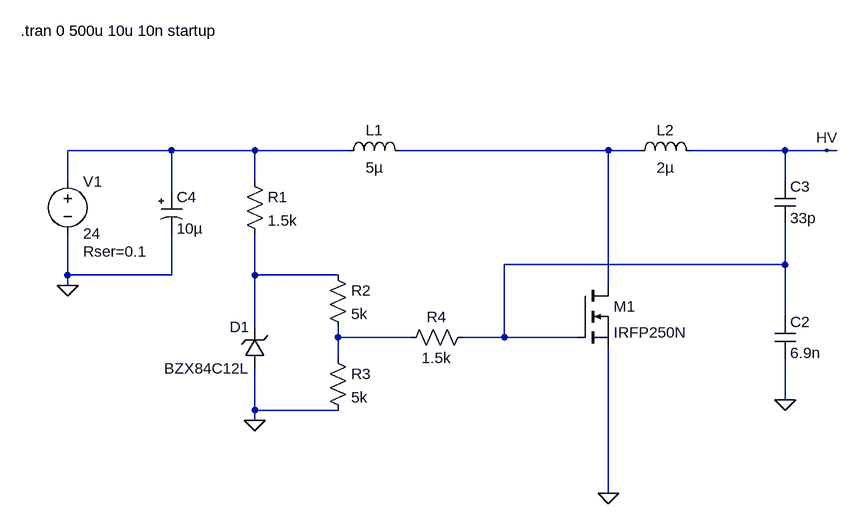
[diagram p0: schematic Generator_spice.asc]
Generator_spice.asc, the LTspice schematic file:
Version 4
SHEET 1 1444 804
WIRE 160 64 0 64
WIRE 288 64 160 64
WIRE 432 64 288 64
WIRE 832 64 512 64
WIRE 880 64 832 64
WIRE 1104 64 960 64
WIRE 1168 64 1104 64
WIRE 1184 64 1168 64
WIRE 0 112 0 64
WIRE 288 112 288 64
WIRE 1104 112 1104 64
WIRE 160 128 160 64
WIRE 1104 240 1104 176
WIRE 1104 240 672 240
WIRE 0 256 0 192
WIRE 160 256 160 192
WIRE 160 256 0 256
WIRE 288 256 288 192
WIRE 416 256 288 256
WIRE 0 272 0 256
WIRE 832 272 832 64
WIRE 1104 320 1104 240
WIRE 288 336 288 256
WIRE 416 352 416 336
WIRE 528 352 416 352
WIRE 672 352 672 240
WIRE 672 352 608 352
WIRE 784 352 672 352
WIRE 416 384 416 352
WIRE 1104 448 1104 384
WIRE 288 464 288 400
WIRE 416 464 288 464
WIRE 288 480 288 464
WIRE 832 592 832 368
FLAG 0 272 0
FLAG 288 480 0
FLAG 1104 448 0
FLAG 832 592 0
FLAG 1168 64 HV
SYMBOL voltage 0 96 R0
WINDOW 123 0 0 Left 0
WINDOW 39 24 124 Left 2
SYMATTR SpiceLine Rser=0.1
SYMATTR InstName V1
SYMATTR Value 24
SYMBOL res 272 96 R0
SYMATTR InstName R1
SYMATTR Value 1.5k
SYMBOL zener 304 400 R180
WINDOW 0 24 64 Left 2
WINDOW 3 24 0 Left 2
SYMATTR InstName D1
SYMATTR Value BZX84C12L
SYMBOL res 400 240 R0
SYMATTR InstName R2
SYMATTR Value 5k
SYMBOL res 400 368 R0
SYMATTR InstName R3
SYMATTR Value 5k
SYMBOL res 624 336 R90
WINDOW 0 0 56 VBottom 2
WINDOW 3 32 56 VTop 2
SYMATTR InstName R4
SYMATTR Value 1.5k
SYMBOL ind 416 80 R270
WINDOW 0 32 56 VTop 2
WINDOW 3 5 56 VBottom 2
SYMATTR InstName L1
SYMATTR Value 5µ
SYMBOL ind 864 80 R270
WINDOW 0 32 56 VTop 2
WINDOW 3 5 56 VBottom 2
SYMATTR InstName L2
SYMATTR Value 2µ
SYMBOL cap 1088 320 R0
SYMATTR InstName C2
SYMATTR Value 6.9n
SYMBOL cap 1088 112 R0
SYMATTR InstName C3
SYMATTR Value 33p
SYMBOL polcap 144 128 R0
SYMATTR InstName C4
SYMATTR Value 10µ
SYMBOL nmos 784 272 R0
SYMATTR InstName M1
SYMATTR Value IRFP250N
TEXT -72 -120 Left 2 !.tran 0 500u 10u 10n startup

The netlist it stands for:
* Generator_spice.asc
V1 N001 0 24 Rser=0.1
R1 N001 N004 1.5k
D1 0 N004 BZX84C12L
R2 N004 N005 5k
R3 N005 0 5k
R4 N003 N005 1.5k
L1 N001 N002 5µ
L2 N002 HV 2µ
C2 N003 0 6.9n
C3 HV N003 33p
C4 N001 0 10µ
M1 N002 N003 0 0 IRFP250N
.model D D
.lib standard.dio
.model NMOS NMOS
.model PMOS PMOS
.lib standard.mos
.tran 0 500u 10u 10n startup
.backanno
.end